# Altium schematic sheet Battery Sensor.SchDoc
size A4
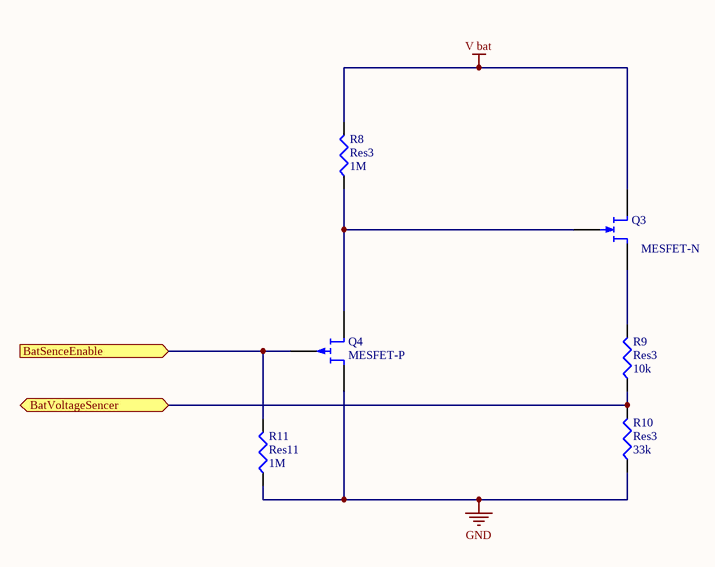
[diagram p0: Battery Sensor.SchDoc]

## Parts
Q3  MESFET-N  [ONSC-SOT-323-3-419-04_V]
Q4  MESFET-P  [ONSC-SOT-323-3-419-04_V]
R8  Res3  value 1M  [0402]
R9  Res3  value 10k  [0402]
R10  Res3  value 33k  [0402]
R11  Res11  value 1M  [0402]

## Ports
BatSenceEnable (in), BatVoltageSencer (bidir)

## Nets
GND: Q4.1(D) R10.1 R11.1
V bat: Q3.1(D) R8.2
BatSenceEnable: Q4.2(G) R11.2 ; port BatSenceEnable
BatVoltageSencer: R9.1 R10.2 ; port BatVoltageSencer
NetQ3_2: Q3.2(G) Q4.3(S) R8.1
NetQ3_3: Q3.3(S) R9.2

## Library data of the parts
Q3 = MESFET-N: N-Channel MESFET; Published: 8-Jun-2000; LatestRevisionDate: 17-Jul-2002; LatestRevisionNote: Re-released for DXP Platform.; PackageReference: TO-18; Publisher: Altium Limited; PackageDescription: Can; 3 Leads; Pin Circle Dia. 2.54 mm; Lead Dia. 0.48 mm (max); Code_JEDEC: TO-18
Q4 = MESFET-P: P-Channel MESFET; Published: 8-Jun-2000; LatestRevisionDate: 17-Jul-2002; LatestRevisionNote: Re-released for DXP Platform.; PackageReference: TO-18; Publisher: Altium Limited; PackageDescription: Can; 3 Leads; Pin Circle Dia. 2.54 mm; Lead Dia. 0.48 mm (max); Code_JEDEC: TO-18
R8-R11 = Res3: Resistor; Published: 8-Jun-2000; LatestRevisionDate: 29-May-2009; LatestRevisionNote: IPC-7351 Footprint Added.; PackageReference: J1-0603; Publisher: Altium Limited; PackageDescription: Chip Resistor